# Altium schematic sheet Safety Loops.SchDoc
size A4
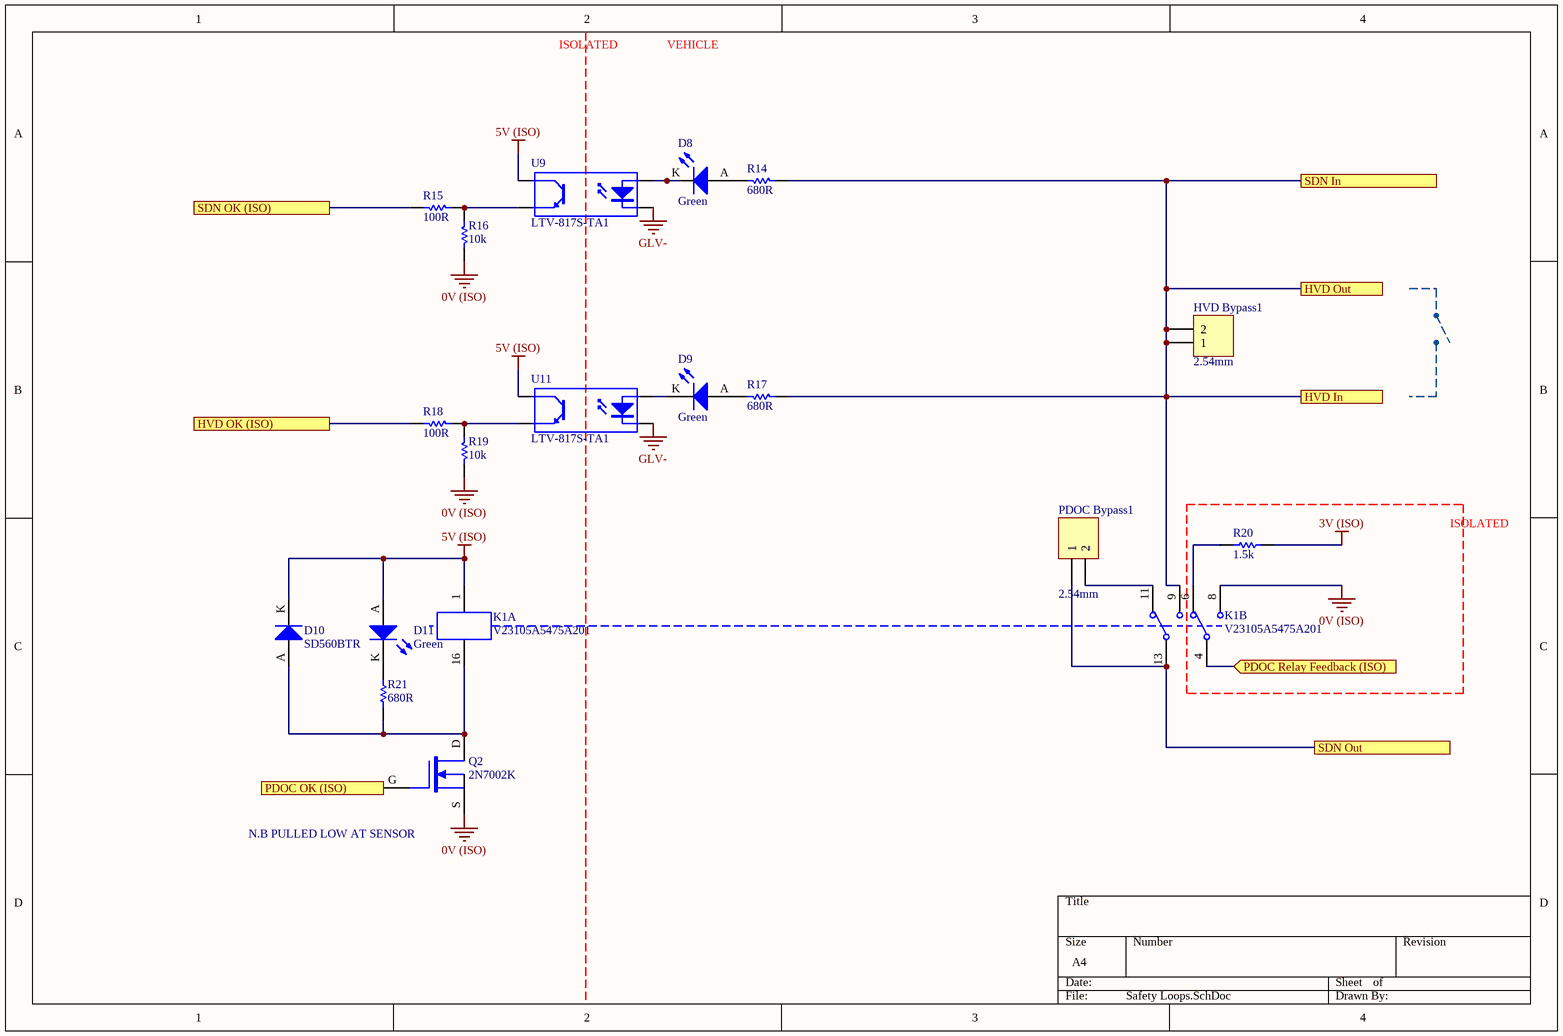
[diagram p0: Safety Loops.SchDoc]

## Parts
D8  Green  [0805 LED]
D9  Green  [0805 LED]
D10  SD560BTR  [SMB Diode]
D11  Green  [0805 LED]
HVD_Bypass1  2.54mm  [TH 2.54mm Header 1x2]
K1  V23105A5475A201  [TI 2-DIL]  (parts A,B of 2)
PDOC_Bypass1  2.54mm  [TH 2.54mm Header 1x2]
Q2  2N7002K  [SOT-343_N]
R14  680R  [0805]
R15  100R  [0805]
R16  10k  [0805]
R17  680R  [0805]
R18  100R  [0805]
R19  10k  [0805]
R20  1.5k  [0805]
R21  680R  [0805]
U9  LTV-817S-TA1  [ON 4-SMD]
U11  LTV-817S-TA1  [ON 4-SMD]

## Blocks framed on the sheet
ISOLATED: K1 R20

## Ports
HVD In, HVD OK (ISO), HVD Out, PDOC OK (ISO), PDOC Relay Feedback (ISO) (in), SDN In, SDN OK (ISO), SDN Out

## Nets
0V (ISO): K1.8 Q2.S R16.1 R19.1
3V (ISO): R20.2
5V (ISO): D10.K D11.A K1.1 U9.4(C) U11.4(C)
GLV-: U9.2(K) U11.2(K)
HVD In: HVD_Bypass1.1 HVD_Bypass1.2 K1.9 R14.2 R17.2 ; port HVD Out, port HVD In, port SDN In
HVD OK (ISO): R18.2 ; port HVD OK (ISO)
PDOC OK (ISO): Q2.G ; port PDOC OK (ISO)
PDOC Relay Feedback (ISO): K1.4 ; port PDOC Relay Feedback (ISO)
SDN OK (ISO): R15.2 ; port SDN OK (ISO)
SDN Out: K1.13 PDOC_Bypass1.1 ; port SDN Out
NetD8_A: D8.A R14.1
NetD8_K: D8.K U9.1(A)
NetD9_A: D9.A R17.1
NetD9_K: D9.K U11.1(A)
NetD10_A: D10.A K1.16 Q2.D R21.1
NetD11_K: D11.K R21.2
NetK1_6: K1.6 R20.1
NetK1_11: K1.11 PDOC_Bypass1.2
NetR15_1: R15.1 R16.2 U9.3(E)
NetR18_1: R18.1 R19.2 U11.3(E)

## Notes on the sheet
- ISOLATED
- VEHICLE
- (near Q2) N.B PULLED LOW AT SENSOR

## Library data of the parts
D8 D9 D11 = SML-210FTT86: Green LED Indication - Discrete 1.75V 0805 (2012 Metric); Manufacturer: ROHM Semiconductor; Part Number: SML-210FTT86; Colour: Green; Digikey Part Number: 511-1285-1-ND; Digikey Link: https://www.digikey.com/product-detail/en/rohm-semiconductor/SML-210FTT86/511-1285-1-ND/637098
D10 = SD560BTR: 1.2V_F 600V 5A SMB; Manufacturer: SMC Diode Solutions; Part Number: SD560BTR; Digikey Part Number: 1655-1530-2-ND; Digikey Link: https://www.digikey.com/product-detail/en/smc-diode-solutions/SD560BTR/1655-1530-2-ND/6022620
HVD_Bypass1 PDOC_Bypass1 = TH 2.54mm Header 1x2: Positions: 2; Angle: 0; Flange: No; Contact: NA; Part Number: TH 2.54mm Header 1x2; Pitch: 2.54mm; Row Spacing: 2.54mm
K1 = V23105A5475A201: 5V DPDT Relay 3A 220VDC; Manufacturer: Axicom; Part Number: V23105A5475A201; Digikey Part Number: PB383-ND; Digikey Link: https://www.digikey.com/products/en?mpart=V23105A5001A201&v=41
Q2 = 2N7002K: 60V 380mA, NFET MOSTFET (Small Signal); Manufacturer: ON Semiconductor; Published: 24-Mar-1999; LatestRevisionDate: 29-May-2009; LatestRevisionNote: IPC-7351 Footprint Added.; PackageVersion: Sep-2000; PackageReference: SOT-343; Publisher: Altium Limited; PackageDescription: 4-Pin SOT-343 Package 1.3 mm Pitch, 2.1 mm Lead Span; Part Number: 2N7002K; Digikey Part Number: 2N7002KCT-ND; Digikey Link: https://www.digikey.com/product-detail/en/on-semiconductor/2N7002K/2N7002KCT-ND/2060375; Qty: 30
R14 R17 R21 = RC0805FR07680RL: Manufacturer: YAGEO; Tolerance: 0.01; Rated Voltage: 0.125W; Part Number: RC0805FR07680RL; Value: 680R; Material: FR-07
R15 R18 = RC0805FR07100RL: Manufacturer: YAGEO; Tolerance: 0.01; Rated Voltage: 0.125W; Part Number: RC0805FR07100RL; Value: 100R; Material: FR-07
R16 R19 = RC0805FR0710KL: Manufacturer: YAGEO; Tolerance: 0.01; Rated Voltage: 0.125W; Part Number: RC0805FR0710KL; Value: 10k; Material: FR-07
R20 = RC0805FR071K5L: Manufacturer: YAGEO; Tolerance: 0.01; Rated Voltage: 0.125W; Part Number: RC0805FR071K5L; Value: 1.5k; Material: FR-07
U9 U11 = LTV-817S-TA1: 35V 50ma Optocoupler (VF=1.2V); Manufacturer: Lite-On Inc; Part Number: LTV-817S-TA1; Digikey Part Number: 160-1893-2-ND; Digikey Link: https://www.digikey.com/product-detail/en/lite-on-inc/LTV-817S-TA1/160-1893-2-ND/388451